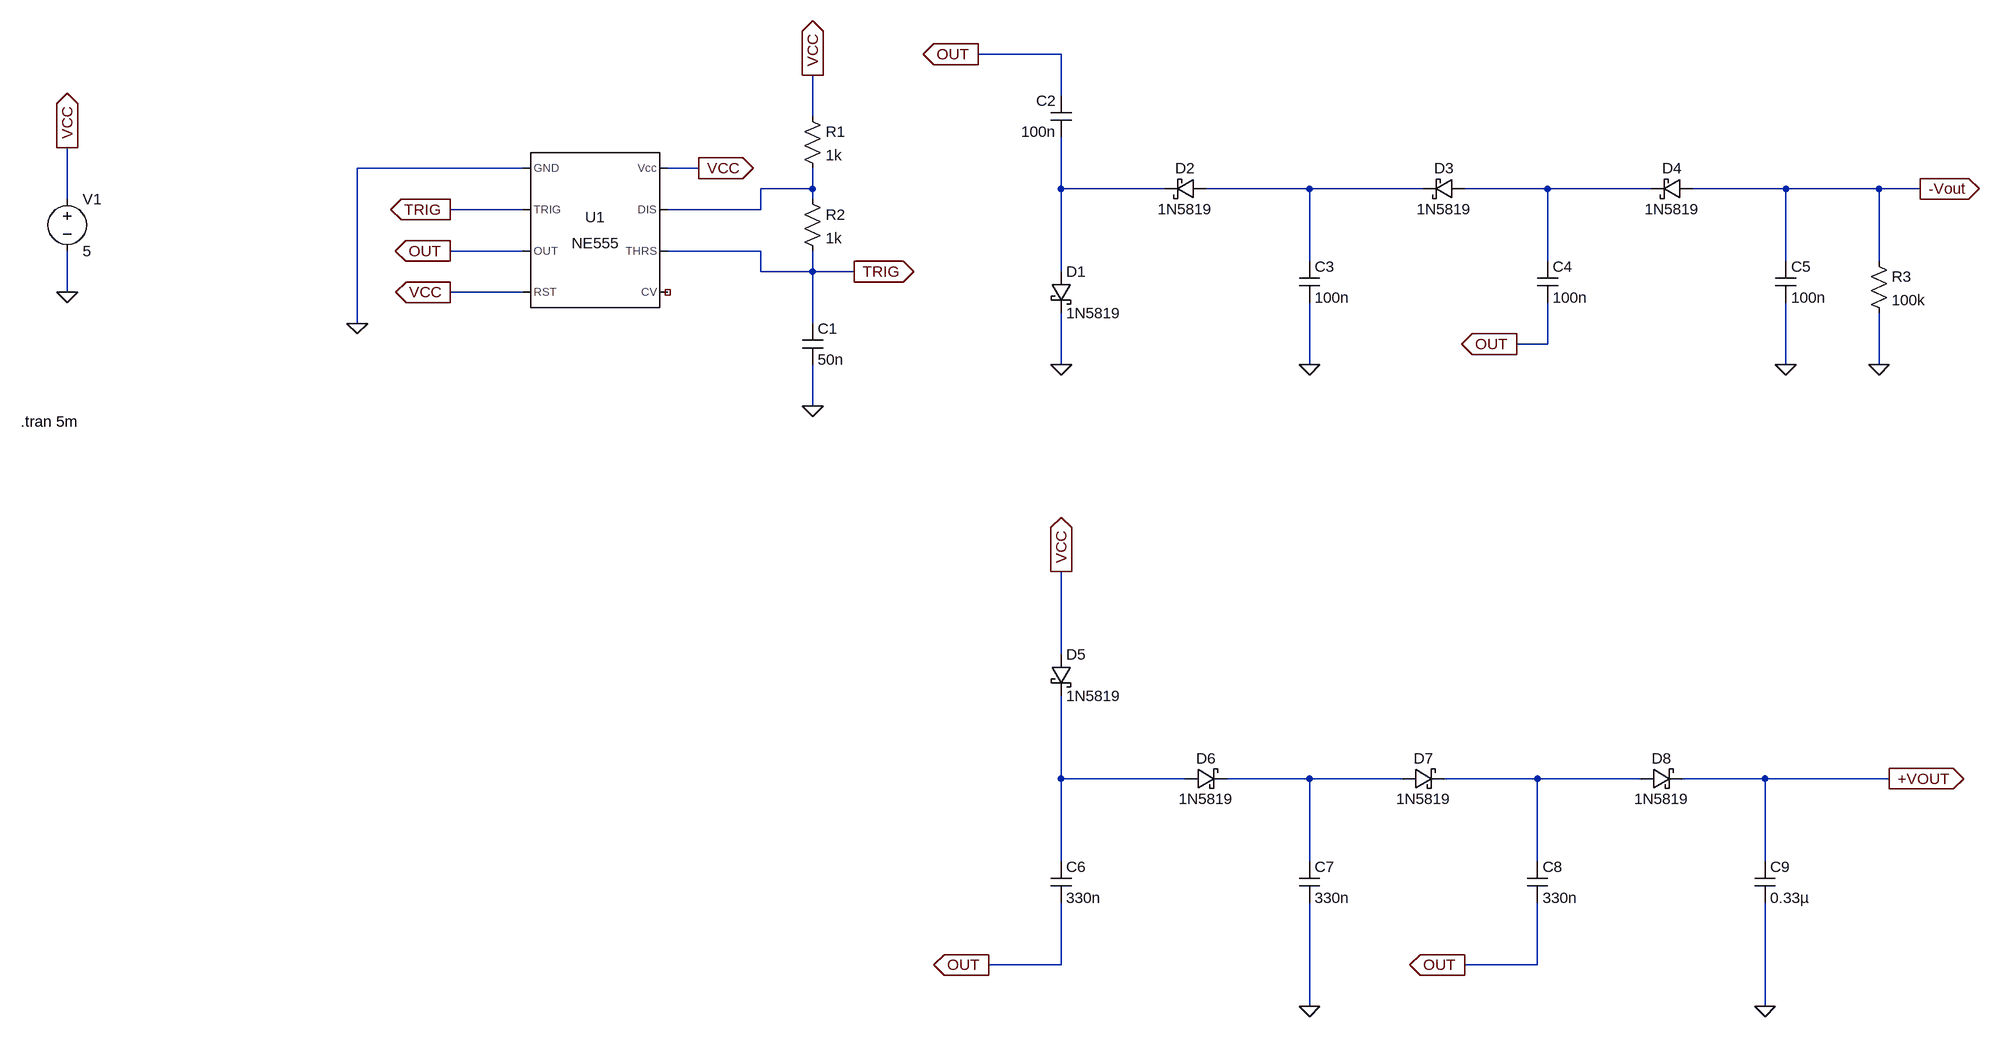
[diagram p0: schematic Charge_pump.asc]
Charge_pump.asc, the LTspice schematic file:
Version 4
SHEET 1 2224 1524
WIRE 752 -96 624 -96
WIRE 752 -32 752 -96
WIRE 368 0 368 -64
WIRE -80 80 -336 80
WIRE 192 80 144 80
WIRE 368 112 368 80
WIRE 368 112 288 112
WIRE 752 112 752 32
WIRE 912 112 752 112
WIRE 1136 112 976 112
WIRE 1312 112 1136 112
WIRE 1504 112 1376 112
WIRE 1664 112 1504 112
WIRE 1872 112 1728 112
WIRE 2016 112 1872 112
WIRE 2080 112 2016 112
WIRE -784 128 -784 48
WIRE 368 128 368 112
WIRE -80 144 -192 144
WIRE 288 144 288 112
WIRE 288 144 144 144
WIRE -80 208 -192 208
WIRE 288 208 144 208
WIRE 1136 224 1136 112
WIRE 1504 224 1504 112
WIRE 1872 224 1872 112
WIRE 2016 224 2016 112
WIRE 288 240 288 208
WIRE 368 240 368 208
WIRE 368 240 288 240
WIRE 432 240 368 240
WIRE 752 240 752 112
WIRE -784 272 -784 208
WIRE -80 272 -192 272
WIRE -336 320 -336 80
WIRE 368 320 368 240
WIRE 1504 352 1504 288
WIRE 1504 352 1456 352
WIRE 752 384 752 304
WIRE 1136 384 1136 288
WIRE 1872 384 1872 288
WIRE 2016 384 2016 304
WIRE 368 448 368 384
WIRE 752 832 752 704
WIRE 752 1024 752 896
WIRE 944 1024 752 1024
WIRE 1136 1024 1008 1024
WIRE 1280 1024 1136 1024
WIRE 1488 1024 1344 1024
WIRE 1648 1024 1488 1024
WIRE 1840 1024 1712 1024
WIRE 2032 1024 1840 1024
WIRE 752 1152 752 1024
WIRE 1136 1152 1136 1024
WIRE 1488 1152 1488 1024
WIRE 1840 1152 1840 1024
WIRE 752 1312 752 1216
WIRE 752 1312 640 1312
WIRE 1488 1312 1488 1216
WIRE 1488 1312 1376 1312
WIRE 1136 1376 1136 1216
WIRE 1840 1376 1840 1216
FLAG -784 272 0
FLAG -784 48 VCC
IOPIN -784 48 Out
FLAG -192 272 VCC
IOPIN -192 272 Out
FLAG 192 80 VCC
IOPIN 192 80 Out
FLAG -336 320 0
FLAG 368 -64 VCC
IOPIN 368 -64 Out
FLAG 368 448 0
FLAG -192 144 TRIG
IOPIN -192 144 Out
FLAG 432 240 TRIG
IOPIN 432 240 Out
FLAG -192 208 OUT
IOPIN -192 208 Out
FLAG 752 384 0
FLAG 1872 384 0
FLAG 624 -96 OUT
IOPIN 624 -96 Out
FLAG 1456 352 OUT
IOPIN 1456 352 Out
FLAG 2080 112 -Vout
IOPIN 2080 112 Out
FLAG 2016 384 0
FLAG 1136 384 0
FLAG 752 704 VCC
IOPIN 752 704 Out
FLAG 1136 1376 0
FLAG 1840 1376 0
FLAG 640 1312 OUT
IOPIN 640 1312 Out
FLAG 1376 1312 OUT
IOPIN 1376 1312 Out
FLAG 2032 1024 +VOUT
IOPIN 2032 1024 Out
SYMBOL Misc\\NE555 32 176 R0
SYMATTR InstName U1
SYMBOL voltage -784 112 R0
WINDOW 123 0 0 Left 0
WINDOW 39 0 0 Left 0
SYMATTR InstName V1
SYMATTR Value 5
SYMBOL res 352 -16 R0
SYMATTR InstName R1
SYMATTR Value 1k
SYMBOL res 352 112 R0
SYMATTR InstName R2
SYMATTR Value 1k
SYMBOL cap 352 320 R0
SYMATTR InstName C1
SYMATTR Value 50n
SYMBOL schottky 736 240 R0
SYMATTR InstName D1
SYMATTR Value 1N5819
SYMATTR Description Diode
SYMATTR Type diode
SYMBOL schottky 976 96 R90
WINDOW 0 0 32 VBottom 2
WINDOW 3 32 32 VTop 2
SYMATTR InstName D2
SYMATTR Value 1N5819
SYMATTR Description Diode
SYMATTR Type diode
SYMBOL schottky 1376 96 R90
WINDOW 0 0 32 VBottom 2
WINDOW 3 32 32 VTop 2
SYMATTR InstName D3
SYMATTR Value 1N5819
SYMATTR Description Diode
SYMATTR Type diode
SYMBOL schottky 1728 96 R90
WINDOW 0 0 32 VBottom 2
WINDOW 3 32 32 VTop 2
SYMATTR InstName D4
SYMATTR Value 1N5819
SYMATTR Description Diode
SYMATTR Type diode
SYMBOL cap 768 32 R180
WINDOW 0 24 56 Left 2
WINDOW 3 24 8 Left 2
SYMATTR InstName C2
SYMATTR Value 100n
SYMBOL cap 1120 224 R0
SYMATTR InstName C3
SYMATTR Value 100n
SYMBOL cap 1488 224 R0
SYMATTR InstName C4
SYMATTR Value 100n
SYMBOL cap 1856 224 R0
SYMATTR InstName C5
SYMATTR Value 100n
SYMBOL res 2000 208 R0
SYMATTR InstName R3
SYMATTR Value 100k
SYMBOL schottky 736 832 R0
SYMATTR InstName D5
SYMATTR Value 1N5819
SYMATTR Description Diode
SYMATTR Type diode
SYMBOL schottky 944 1040 R270
WINDOW 0 32 32 VTop 2
WINDOW 3 0 32 VBottom 2
SYMATTR InstName D6
SYMATTR Value 1N5819
SYMATTR Description Diode
SYMATTR Type diode
SYMBOL schottky 1280 1040 R270
WINDOW 0 32 32 VTop 2
WINDOW 3 0 32 VBottom 2
SYMATTR InstName D7
SYMATTR Value 1N5819
SYMATTR Description Diode
SYMATTR Type diode
SYMBOL schottky 1648 1040 R270
WINDOW 0 32 32 VTop 2
WINDOW 3 0 32 VBottom 2
SYMATTR InstName D8
SYMATTR Value 1N5819
SYMATTR Description Diode
SYMATTR Type diode
SYMBOL cap 736 1152 R0
SYMATTR InstName C6
SYMATTR Value 330n
SYMBOL cap 1120 1152 R0
SYMATTR InstName C7
SYMATTR Value 330n
SYMBOL cap 1472 1152 R0
SYMATTR InstName C8
SYMATTR Value 330n
SYMBOL cap 1824 1152 R0
SYMATTR InstName C9
SYMATTR Value 0.33µ
SYMATTR SpiceLine V=4 Irms=3.06 Rser=0.040038 Lser=0 mfg="KEMET" pn="C0603C334K7PAC" type="X5R"
TEXT -856 472 Left 2 !.tran 5m

The netlist it stands for:
* Charge_pump.asc
XU1 0 TRIG OUT VCC NC_01 TRIG N001 VCC NE555  ; pins GND TRIG OUT RST CV THRS DIS Vcc
V1 VCC 0 5
R1 VCC N001 1k
R2 N001 TRIG 1k
C1 TRIG 0 50n
D1 N002 0 1N5819
D2 N003 N002 1N5819
D3 N004 N003 1N5819
D4 -Vout N004 1N5819
C2 N002 OUT 100n
C3 N003 0 100n
C4 N004 OUT 100n
C5 -Vout 0 100n
R3 -Vout 0 100k
D5 VCC N005 1N5819
D6 N005 N006 1N5819
D7 N006 N007 1N5819
D8 N007 +VOUT 1N5819
C6 N005 OUT 330n
C7 N006 0 330n
C8 N007 OUT 330n
C9 +VOUT 0 0.33µ V=4 Irms=3.06 Rser=0.040038 Lser=0 mfg="KEMET" pn="C0603C334K7PAC" type="X5R"
.model D D
.lib standard.dio
.tran 5m
.lib NE555.sub
.backanno
.end